# EAGLE design Shield H-Bridge (EAGLE 7.2.0)
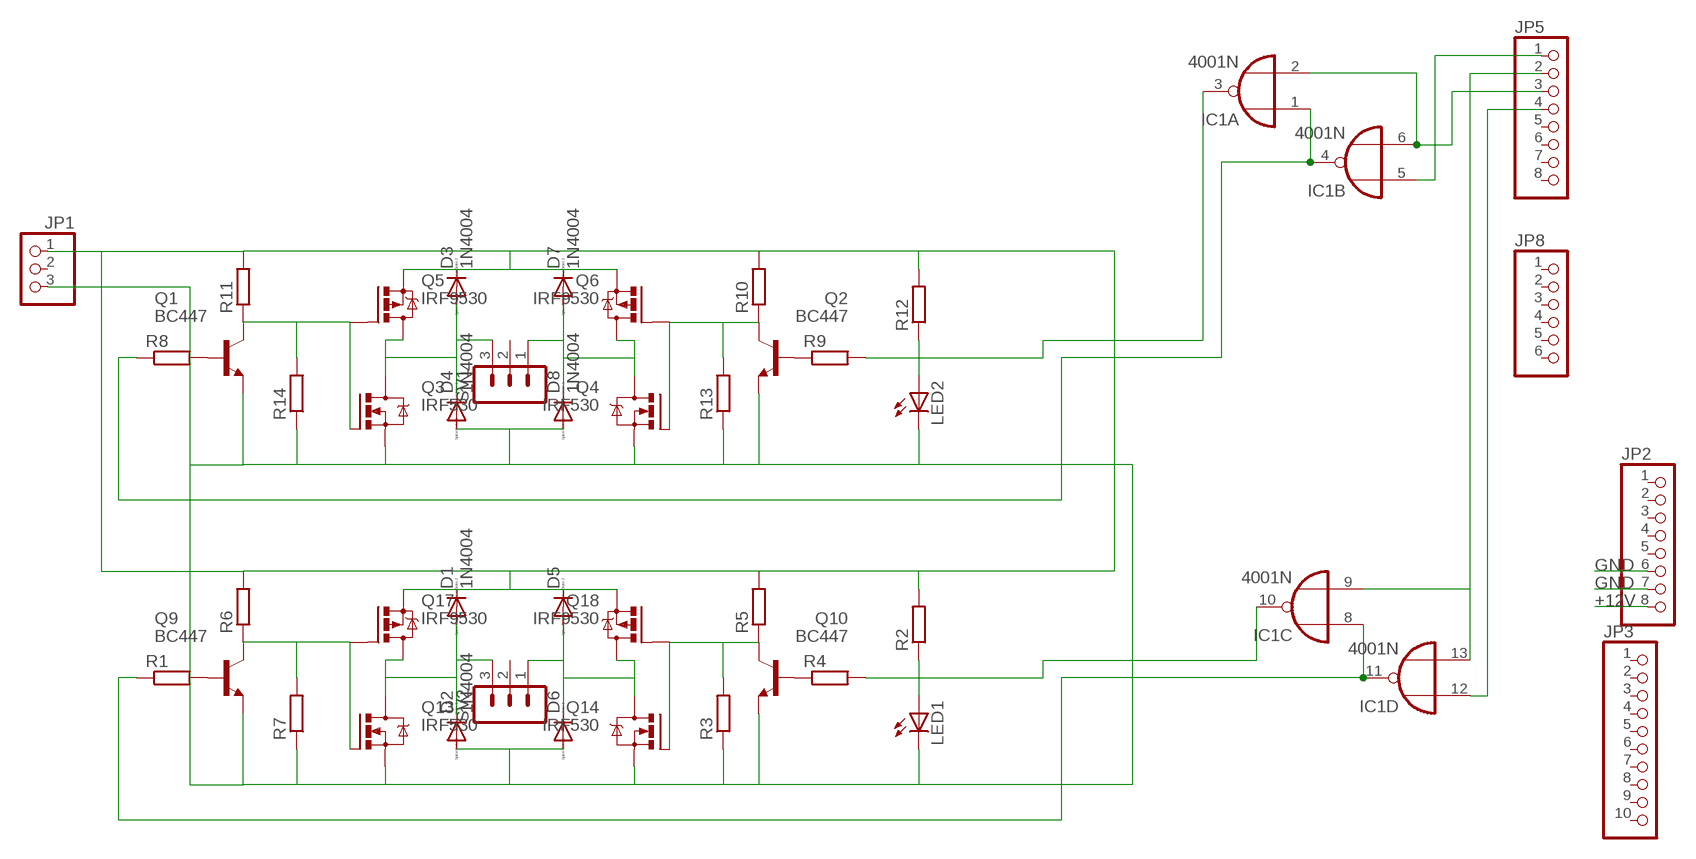
[diagram p0: schematic, sheet 1]

## Parts
D1  1N4004  [DO41-10]
D2  1N4004  [DO41-10]
D3  1N4004  [DO41-10]
D4  1N4004  [DO41-10]
D5  1N4004  [DO41-10]
D6  1N4004  [DO41-10]
D7  1N4004  [DO41-10]
D8  1N4004  [DO41-10]
IC1  4001N  [DIL14]
JP1  PINHD-1X3  [1X03]
JP2  PINHD-1X8  [1X08]
JP3  PINHD-1X10  [1X10]
JP5  PINHD-1X8  [1X08]
JP8  PINHD-1X6  [1X06]
LED1  LED3MM  [LED3MM]
LED2  LED3MM  [LED3MM]
Q1  BC447  [TO92-EBC]
Q2  BC447  [TO92-EBC]
Q3  IRF530  [TO220BV]
Q4  IRF530  [TO220BV]
Q5  IRF9530  [TO220BV]
Q6  IRF9530  [TO220BV]
Q9  BC447  [TO92-EBC]
Q10  BC447  [TO92-EBC]
Q13  IRF530  [TO220BV]
Q14  IRF530  [TO220BV]
Q17  IRF9530  [TO220BV]
Q18  IRF9530  [TO220BV]
R1  R-EU_0207/10  [0207/10]
R2  R-EU_0204/5  [0204/5]
R3  R-EU_0204/7  [0204/7]
R4  R-EU_0207/10  [0207/10]
R5  R-EU_0207/10  [0207/10]
R6  R-EU_0207/10  [0207/10]
R7  R-EU_0204/7  [0204/7]
R8  R-EU_0207/10  [0207/10]
R9  R-EU_0207/10  [0207/10]
R10  R-EU_0207/10  [0207/10]
R11  R-EU_0207/10  [0207/10]
R12  R-EU_0204/5  [0204/5]
R13  R-EU_0204/7  [0204/7]
R14  R-EU_0204/7  [0204/7]
SV1  MA03-1  [MA03-1]
SV2  MA03-1  [MA03-1]

## Nets
+12V: D1.C D3.C D5.C D7.C JP1.1 JP2.8 Q5.S Q6.S Q17.S Q18.S R2.2 R5.2 R6.2 R10.2 R11.2 R12.2
GND: D2.A D4.A D6.A D8.A JP1.3 JP2.6 JP2.7 LED1.K(C) LED2.K(C) Q1.E Q2.E Q3.S Q4.S Q9.E Q10.E Q13.S Q14.S R3.1 R7.1 R13.1 R14.1
N$1: Q9.B R1.2
N$2: Q10.B R4.1
N$3: D7.A D8.C Q4.D Q6.D SV1.1
N$4: IC1.12(D:I0) JP5.4
N$5: D3.A D4.C Q3.D Q5.D SV1.3
N$6: Q2.C Q4.G Q6.G R10.1 R13.2
N$7: D5.A D6.C Q14.D Q18.D SV2.1
N$8: D1.A D2.C Q13.D Q17.D SV2.3
N$9: LED1.A R2.1
N$10: Q1.B R8.2
N$11: Q2.B R9.1
N$12: Q10.C Q14.G Q18.G R3.2 R5.1
N$13: Q1.C Q3.G Q5.G R11.1 R14.2
N$14: LED2.A R12.1
N$15: IC1.2(A:I1) IC1.6(B:I1) JP5.3
N$18: Q9.C Q13.G Q17.G R6.1 R7.2
N$20: IC1.9(C:I1) IC1.13(D:I1) JP5.2
N$22: IC1.5(B:I0) JP5.1
PWM1: IC1.10(C:O) R4.2
PWM2: IC1.8(C:I0) IC1.11(D:O) R1.1
PWM3: IC1.1(A:I0) IC1.4(B:O) R8.1
PWM4: IC1.3(A:O) R9.2
Unconnected: JP1.2 JP2.1 JP2.2 JP2.3 JP2.4 JP2.5 JP3.1 JP3.2 JP3.3 JP3.4 JP3.5 JP3.6 JP3.7 JP3.8 JP3.9 JP3.10 JP5.5 JP5.6 JP5.7 JP5.8 JP8.1 JP8.2 JP8.3 JP8.4 JP8.5 JP8.6 SV1.2 SV2.2

## Power pins joined to a net without a drawn wire
VDD: IC1.14(P:VDD)
VSS: IC1.7(P:VSS)

## Library data of the parts
D1-D8 = diode:1N4004: DIODE general purpose rectifier, 1 A
IC1 = 40xx:4001: Quad 2-input NOR
JP1 = pinhead:PINHD-1X3: PIN HEADER
JP2 JP5 = pinhead:PINHD-1X8: PIN HEADER
JP3 = pinhead:PINHD-1X10: PIN HEADER
JP8 = pinhead:PINHD-1X6: PIN HEADER
LED1 LED2 = led:LED: LED OSRAM: - CHIPLED LG R971, LG N971, LY N971, LG Q971, LY Q971, LO R971, LY R971 LH N974, LH R974 LS Q976, LO Q976, LY Q976 LO Q996 - Hyper CHIPLED LW Q18S LB Q993, LB Q99A, LB R99A - SideLED LS A670, LO A670, LY A670, LG A670, LP A670 LB A673, LV A673, LT A673, LW A673 LH A674 LY A675 LS A676, LA A676, LO A676, LY A676, LW A676 LS A679, LY A679, LG A679 - Hyper Micro SIDELED® LS Y876, LA Y876, LO Y876, LY Y876 LT Y87S - SmartLED LW L88C, LW L88S LB L89C, LB L89S, LG L890 LS L89K, LO L89K, LY L89K LS L896, LA L896, LO L896, LY L896 - TOPLED LS T670, LO T670, LY T670, LG T670, LP T670 LSG T670, LSP T670, LSY T670, LOP T670, LYG T670 LG T671, LOG T671, LSG T671 LB T673, LV T673, LT T673, LW T673 LH T674 LS T676, LA T676, LO T676, LY T676, LB T676, LH T676, LSB T676, LW T676 LB T67C, LV T67C, LT T67C, LS T67K, LO T67K, LY T67K, LW E67C LS E67B, LA E67B, LO E67B, LY E67B, LB E67C, LV E67C, LT E67C LW T67C LS T679, LY T679, LG T679 LS T770, LO T770, LY T770, LG T770, LP T770 LB T773, LV T773, LT T773, LW T773 LH T774 LS E675, LA E675, LY E675, LS T675 LS T776, LA T776, LO T776, LY T776, LB T776 LHGB T686 LT T68C, LB T68C - Hyper Mini TOPLED® LB M676 - Mini TOPLED Santana® LG M470 LS M47K, LO M47K, LY M47K Source: http://www.osram.convergy.de LUXEON: - LUMILED® LXK2-PW12-R00, LXK2-PW12-S00, LXK2-PW14-U00, LXK2-PW14-V00 LXK2-PM12-R00, LXK2-PM12-S00, LXK2-PM14-U00 LXK2-PE12-Q00, LXK2-PE12-R00, LXK2-PE12-S00, LXK2-PE14-T00, LXK2-PE14-U00 LXK2-PB12-K00, LXK2-PB12-L00, LXK2-PB12-M00, LXK2-PB14-N00, LXK2-PB14-P00, LXK2-PB14-Q00 LXK2-PR12-L00, LXK2-PR12-M00, LXK2-PR14-Q00, LXK2-PR14-R00 LXK2-PD12-Q00, LXK2-PD12-R00, LXK2-PD12-S00 LXK2-PH12-R00, LXK2-PH12-S00 LXK2-PL12-P00, LXK2-PL12-Q00, LXK2-PL12-R00 Source: www.luxeon.com KINGBRIGHT: KA-3528ASYC Source: www.kingbright.com
Q1 Q2 Q9 Q10 = transistor-npn:BC447*: NPN Transistor
Q3 Q4 Q13 Q14 = transistor-power:IRF530: HEXFET Power MOSFET
Q5 Q6 Q17 Q18 = transistor-power:IRF9530: P-CHANNEL HEXFET POWER-MOS-FET Source: http://www.irf.com/product-info/datasheets/data/irf9530.pdf
R1-R14 = resistor:R-EU_: RESISTOR, European symbol
SV1 SV2 = con-lstb:MA03-1: PIN HEADER; OC_FARNELL: unknown; OC_NEWARK: unknown

## Board
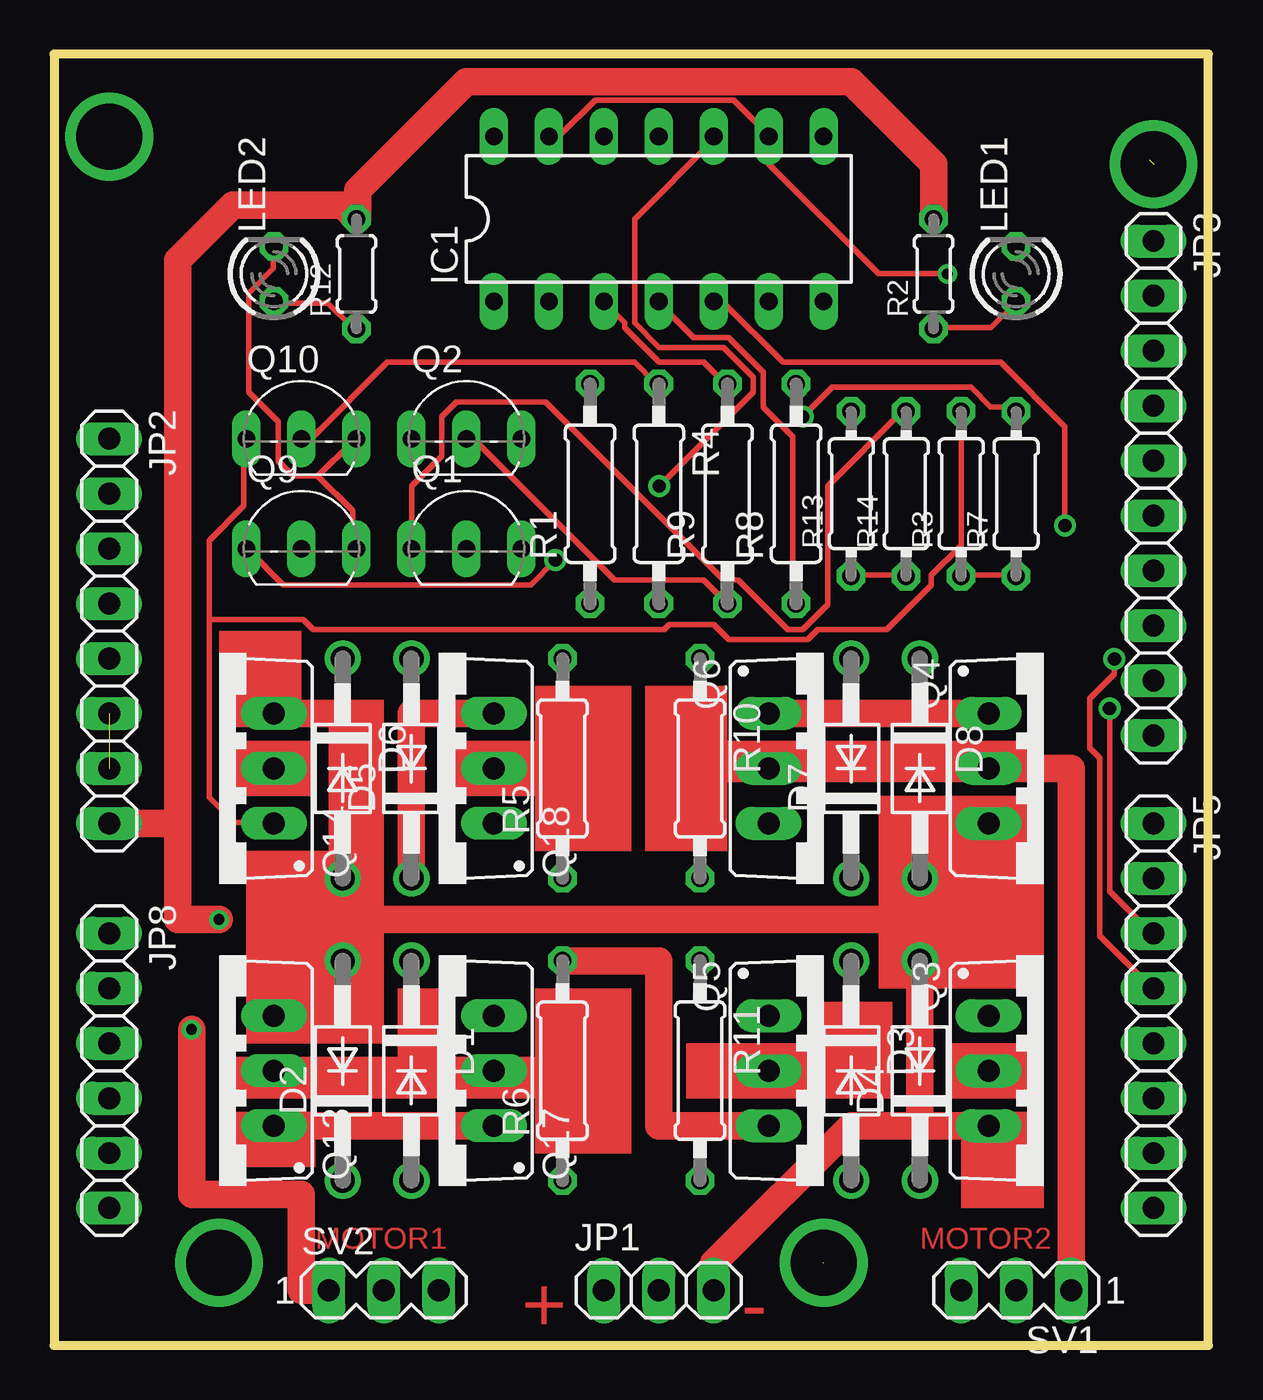
[diagram p1: board, top side]
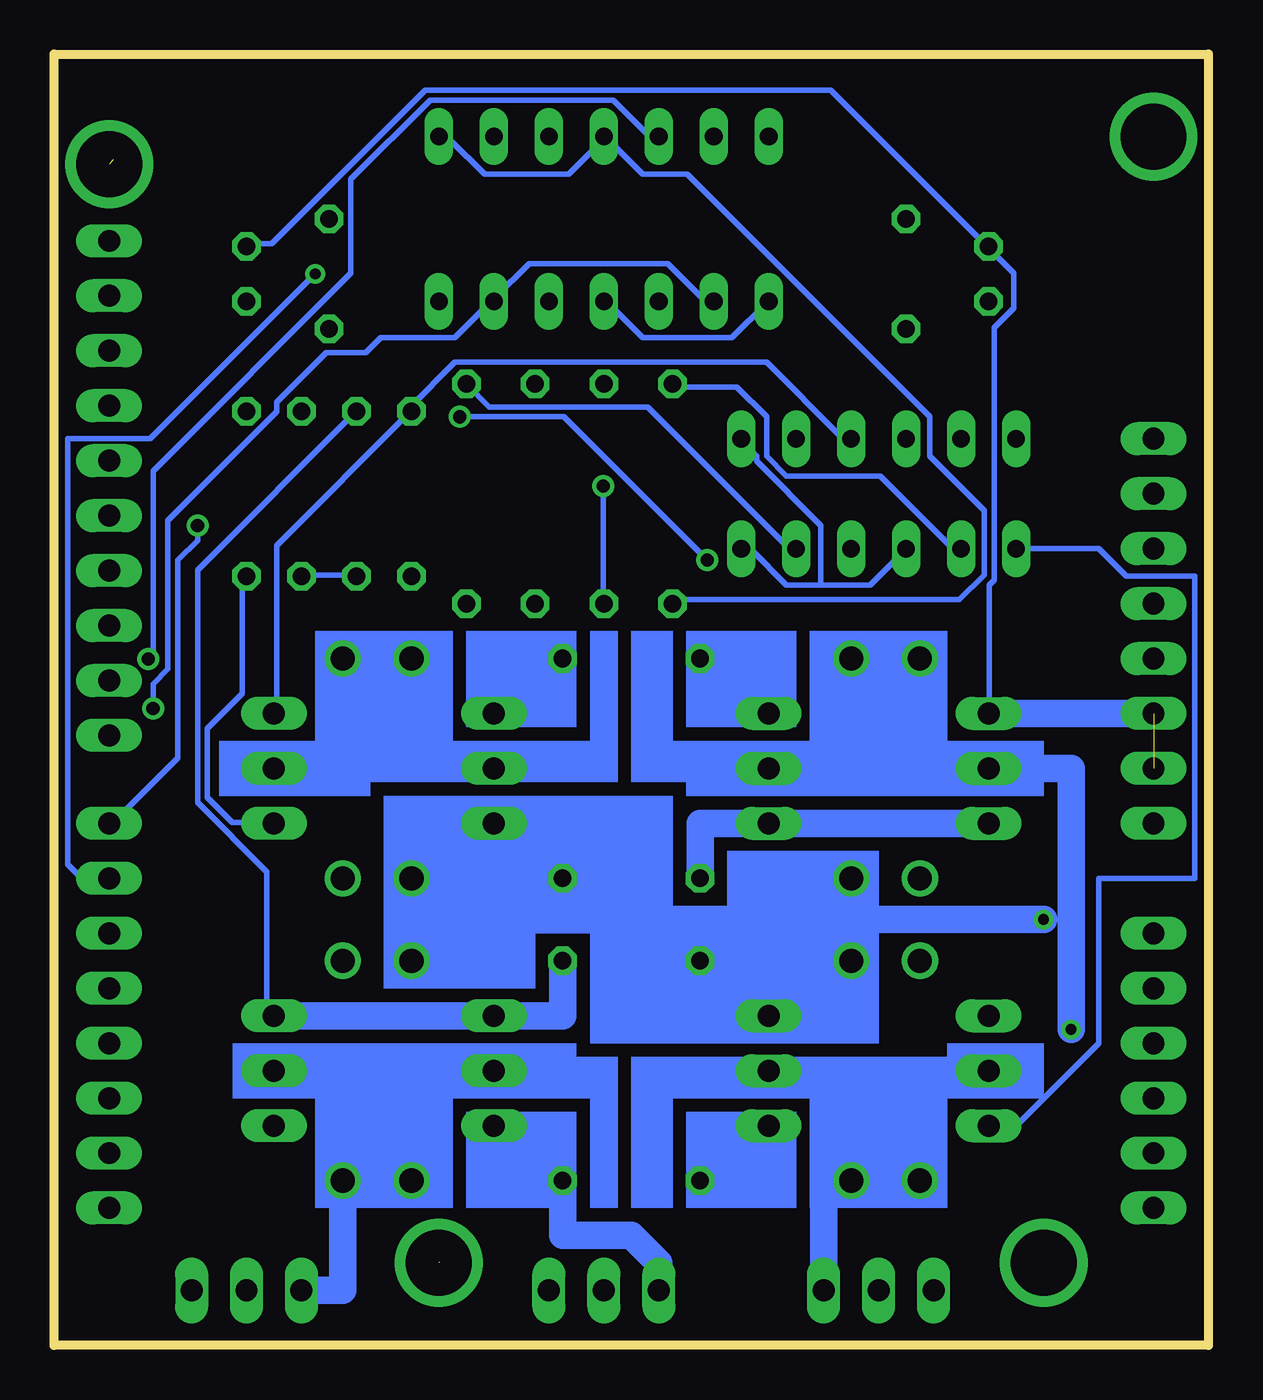
[diagram p2: board, bottom side, seen from below]

Size 53.34 x 59.69 mm. Coordinates in mm from the lower left corner, seen from the top.
Outline: 53.34,59.69 0,59.69 0,0 53.34,0 53.34,59.69
Copper layers (1*16): Top 0.035mm / dielectric 1.5mm / Bottom 0.035mm
Design rules "default": minimum track width 10mil, minimum drill 24mil, track to track 8mil, track to pad 8mil, pad to pad 8mil, via to via 8mil, smd to smd 8mil, copper to edge 40mil, drill to drill 8mil, minimum pad ring 10mil, minimum via ring 8mil, stop-mask expansion 4mil, vias tented up to drill 0mil, thermal gap 10mil

### Footprints (pad centres in the part's own frame; a part is rotated, then mirrored left to right if it is on the bottom)
DO41-10 = drill 1.118: A 5.08,0; C -5.08,0
DIL14 = drill 0.813 long: 1 -7.62,-3.81; 2 -5.08,-3.81; 3 -2.54,-3.81; 4 0,-3.81; 5 2.54,-3.81; 6 5.08,-3.81; 7 7.62,-3.81; 8 7.62,3.81; 9 5.08,3.81; 10 2.54,3.81; 11 0,3.81; 12 -2.54,3.81; 13 -5.08,3.81; 14 -7.62,3.81
1X03 = drill 1.016 long: 1 -2.54,0; 2 0,0; 3 2.54,0
1X08 = drill 1.016 long: 1 -8.89,0; 2 -6.35,0; 3 -3.81,0; 4 -1.27,0; 5 1.27,0; 6 3.81,0; 7 6.35,0; 8 8.89,0
1X10 = drill 1.016 long: 1 -11.43,0; 2 -8.89,0; 3 -6.35,0; 4 -3.81,0; 5 -1.27,0; 6 1.27,0; 7 3.81,0; 8 6.35,0; 9 8.89,0; 10 11.43,0
1X06 = drill 1.016 long: 1 -6.35,0; 2 -3.81,0; 3 -1.27,0; 4 1.27,0; 5 3.81,0; 6 6.35,0
LED3MM = drill 0.813 octagon: A -1.27,0; K 1.27,0
TO92-EBC = drill 0.813 long: B 0,-1.27; C -2.54,-1.27; E 2.54,-1.27
TO220BV = drill 1.016 long: D 0,-2.54; G -2.54,-2.54; S 2.54,-2.54
0207/10 = drill 0.813 octagon: 1 -5.08,0; 2 5.08,0
0204/5 = drill 0.813 octagon: 1 -2.54,0; 2 2.54,0
0204/7 = drill 0.813 octagon: 1 -3.81,0; 2 3.81,0
MA03-1 = drill 1.016 long: 1 -2.54,0; 2 0,0; 3 2.54,0

### Placement (x,y rotation side)
D1  16.51,12.7 270 top
D2  13.34,12.7 90 top
D3  36.83,12.7 270 top
D4  40.01,12.7 90 top
D5  16.51,26.67 90 top
D6  13.34,26.67 270 top
D7  36.83,26.67 90 top
D8  40.01,26.67 270 top
IC1  27.94,52.07 0 top
JP1  27.94,2.54 0 top
JP2  2.54,33.02 270 top
JP3  50.8,39.62 270 top
JP5  50.8,15.24 270 top
JP8  2.54,12.7 270 top
LED1  44.45,49.53 90 top
LED2  10.16,49.53 90 top
Q1  19.05,38.1 0 top
Q2  19.05,43.18 0 top
Q3  45.72,12.7 270 top
Q4  45.72,26.67 270 top
Q5  35.56,12.7 270 top
Q6  35.56,26.67 270 top
Q9  11.43,38.1 0 top
Q10  11.43,43.18 0 top
Q13  7.62,12.7 90 top
Q14  7.62,26.67 90 top
Q17  17.78,12.7 90 top
Q18  17.78,26.67 90 top
R1  24.77,39.37 90 top
R2  40.64,49.53 90 top
R3  41.91,39.37 90 top
R4  27.94,39.37 270 top
R5  23.5,26.67 90 top
R6  23.5,12.7 90 top
R7  44.45,39.37 90 top
R8  34.29,39.37 90 top
R9  31.12,39.37 90 top
R10  29.85,26.67 270 top
R11  29.85,12.7 270 top
R12  13.97,49.53 90 top
R13  36.83,39.37 90 top
R14  39.37,39.37 90 top
SV1  44.45,2.54 180 top
SV2  15.24,2.54 0 top

### Tracks (layer width: path | path; a pad name or v marks a point on that pad's centre or on a via)
+12V  (via drill 0.5)
  Top 0.254: 14.02,52.07 R12.2
  Top 1.27: R6.2 27.94,17.78 27.94,10.16 Q5.S | Q18.S 16.51,29.21 D5.C | v7.62,19.69 5.72,19.69 5.72,24.13 | 5.72,24.13 5.72,50.16 8.26,52.7 13.34,52.7 R12.2 | 14.02,52.07 14.02,53.39 19.05,58.42 36.83,58.42 40.64,54.61 R2.2 | JP2.8 5.72,24.13
  Bottom 1.27: D3.C D7.C 33.02,21.59 | D1.C 20.32,17.78 | 20.32,17.78 R6.2 | 33.02,21.59 R10.2 26.67,21.59 26.67,17.78 R6.2 | Q17.S 20.32,17.78 | Q6.S 33.02,21.59 | Q5.S 29.85,10.16 R11.2 29.85,5.08 26.67,5.08 25.4,3.81 JP1.1 | R6.2 D1.C | D1.C 16.51,19.69 | R5.2 23.5,29.21 Q18.S | D5.C 16.51,19.69 | 16.51,19.69 v7.62,19.69
GND  (1 unrouted)
  Top 0.254: R13.1 36.88,35.61 39.17,35.61 R14.1 | R3.1 41.91,35.61 44.43,35.61 R7.1 | 12.19,40.18 11.05,40.18 10.36,40.87 10.36,42.7 8.99,44.07 8.99,48.64 10.14,49.78 10.14,50.7 LED2.K | 12.19,40.18 13.79,41.78 Q10.E | 12.19,40.18 13.79,38.58 13.79,36.98 Q9.E
  Top 1.27: 40.01,19.05 D8.A 43.18,21.59 Q4.S | 40.01,19.05 D4.A 40.01,10.16 | 13.34,19.69 D2.A 10.16,17.78 Q13.S | 13.34,19.69 D6.A 13.34,29.21 Q14.S | 13.34,19.69 39.37,19.69 40.01,19.05 | JP1.3 30.48,3.81 36.83,10.16 40.01,10.16 | Q3.S 40.01,10.16
  Bottom 0.254: R14.1 39.4,35.61 41.91,35.61 R3.1 | R7.1 44.65,35.38 44.65,30.12 46.25,28.52 46.25,25.32 45.11,24.18 43.28,24.18 Q4.S | 17.91,35.15 15.62,35.15 14.02,36.75 Q9.E | 17.91,35.15 19.51,35.15 21.11,36.75 21.57,36.75 Q1.E | 17.91,35.15 17.91,37.9 20.88,40.87 20.88,41.1 21.57,41.78 Q2.E | LED1.K 44.43,50.93 43.28,50.93 36.2,58.01 17.45,58.01 10.36,50.93 LED2.K 10.14,50.7 8.99,49.55 8.99,47.95 9.91,47.04 9.91,35.38 10.14,35.15 10.14,29.21 Q14.S
  Bottom 1.27: JP2.6 Q14.S
N$1
  Bottom 0.254: Q9.B 11.51,36.98 11.96,36.98 15.16,40.18 19.51,40.18 20.42,41.1 20.42,42.93 21.79,44.3 24.77,44.3 R1.2
N$2
  Top 0.254: Q10.B 11.51,42.01 11.96,42.01 15.39,45.44 26.82,45.44 27.74,44.53 R4.1
N$3
  Top 1.27: SV1.1 46.99,26.67 Q4.D
  Bottom 1.27: Q6.D 40.64,26.67 | 40.64,26.67 Q4.D | D7.A D8.C 40.01,27.3 40.64,26.67
N$4  (via drill 0.61)
  Top 0.254: v49,31.73 49,31.04 47.85,29.9 47.85,27.61 48.31,27.15 48.31,18.92 50.6,16.64 JP5.4
  Bottom 0.254: v49,31.73 48.77,31.95 48.77,40.41 39.62,49.55 39.62,53.9 35.97,57.56 27.51,57.56 25.91,55.96 25.45,55.96 IC1.12
N$5
  Bottom 1.27: Q3.D 36.83,12.7 | 36.83,12.7 Q5.D | 36.83,12.7 D3.A D4.C 40.01,2.54 SV1.3
N$6
  Top 1.27: Q4.G Q6.G
  Bottom 0.254: Q2.C 16.54,42.01 16.99,42.01 20.42,45.44 34.82,45.44 36.88,43.38 R13.2 36.88,43.16 43.05,36.98 43.05,29.21 Q4.G
  Bottom 1.27: Q6.G 29.85,29.21 R10.1
N$7  (via drill 0.5)
  Top 1.27: v6.35,14.61 6.35,6.98 11.43,6.98 11.43,2.54 SV2.1
  Bottom 1.27: D5.A D6.C 13.34,27.3 13.97,26.67 | Q14.D 13.97,26.67 | 13.97,26.67 Q18.D Q14.D | Q14.D 6.35,26.67 v6.35,14.61
N$8
  Top 0.254: 16.54,7.49 D1.A
  Bottom 1.27: Q13.D 13.34,12.7 | 13.34,12.7 Q17.D | 13.34,12.7 D2.C D1.A 17.78,7.62 SV2.3
N$9
  Top 0.254: R2.1 40.77,47.04 43.28,47.04 44.43,48.18 LED1.A
N$10
  Bottom 0.254: R8.2 33.22,43.38 25.91,43.38 19.51,36.98 19.05,36.98 Q1.B
N$11
  Top 0.254: R9.1 30.02,35.38 25.91,35.38 19.51,41.78 19.05,41.78 Q2.B
N$12
  Top 0.254: 7.16,33.55 7.16,25.32 8.31,24.18 10.14,24.18 Q14.G | 7.16,33.55 7.16,37.21 8.76,38.81 8.76,41.78 Q10.C | R3.2 41.91,36.98 40.54,35.61 40.54,35.15 38.48,33.1 35.28,33.1 34.82,32.64 31.17,32.64 30.48,33.33 28.42,33.33 28.19,33.1 11.96,33.1 11.51,33.55 7.16,33.55
  Bottom 1.27: Q14.G Q18.G 23.5,24.13 R5.1
N$13
  Top 0.254: Q1.C 16.54,36.98 16.54,39.73 17.91,41.1 17.91,42.93 18.59,43.61 22.71,43.61 30.94,35.38 31.62,35.38 33.91,33.1 34.59,33.1 35.74,34.24 35.74,39.73 39.17,43.16 R14.2
  Bottom 0.254: R14.2 46.71,35.84 46.71,25.09 43.51,21.89 43.51,15.72 Q3.G
  Bottom 1.27: Q3.G Q5.G 29.85,15.24 R11.1
N$14
  Top 0.254: LED2.A 10.36,48.18 12.65,48.18 13.79,47.04 R12.1
N$15  (via drill 0.61)
  Top 0.254: v48.77,29.44 48.77,20.98 50.6,19.15 JP5.3
  Bottom 0.254: IC1.2 22.94,48.41 23.39,48.41 24.99,50.01 31.39,50.01 33,48.41 IC1.6 33.22,48.18 34.82,46.58 38.25,46.58 38.94,45.9 40.77,45.9 43.05,43.61 43.05,43.16 48.08,38.12 48.08,31.27 48.77,30.58 v48.77,29.44
N$16  (via drill 3.05 pad 4.06)
  other vias: 2.54,55.88
N$18  (via drill 0.61)
  Top 0.254: v34.59,42.93 35.97,44.3 42.37,44.3 43.28,43.38 44.43,43.38 R7.2 | v23.17,36.3 22.02,35.15 10.59,35.15 8.99,36.75 Q9.C
  Top 1.27: Q13.G Q17.G
  Bottom 0.254: v34.59,42.93 29.79,42.93 v23.17,36.3 | Q13.G 8.89,10.16 5.08,13.97 5.08,21.59 0.64,21.59 0.64,35.56 3.81,35.56 5.08,36.83 Q9.C
  Bottom 1.27: Q17.G 23.5,10.16 R6.1
N$19  (via drill 3.05 pad 4.06)  (1 unrouted)
  other vias: 50.8,54.61
N$20  (via drill 0.5)
  Top 0.254: IC1.13 22.94,55.96 23.39,55.96 24.99,57.56 31.39,57.56 33,55.96 IC1.9 33.02,54.61 38.1,49.53 v41.28,49.53
  Bottom 0.254: v41.28,49.53 48.9,41.91 52.71,41.91 52.71,22.22 52.07,21.59 JP5.2
N$21  (via drill 3.05 pad 4.06)
  other vias: 7.62,3.81
N$22  (via drill 0.61)
  Top 0.254: v46.71,37.9 46.71,42.47 43.74,45.44 33.68,45.44 30.94,48.18 30.48,48.18 IC1.5
  Bottom 0.254: v46.71,37.9 46.71,37.21 47.62,36.3 47.62,27.15 50.6,24.18 JP5.1
N$23  (via drill 3.05 pad 4.06)  (1 unrouted)
  other vias: 35.56,3.81
PWM1  (via drill 0.61)
  Top 0.254: v27.97,39.73 32.31,44.07 32.31,44.76 30.94,46.13 27.97,46.13 26.82,47.27 26.82,52.07 30.48,55.73 IC1.10
  Bottom 0.254: v27.97,39.73 27.97,34.47 R4.2
PWM2
  Bottom 0.254: R1.1 24.77,34.47 11.51,34.47 10.36,35.61 10.36,38.58 12.88,41.1 12.88,42.93 24.08,54.13 26.14,54.13 27.74,55.73 IC1.11 27.97,55.73 29.57,54.13 33.45,54.13 35.05,55.73 35.51,55.73 IC1.8
PWM3
  Top 0.254: R8.1 34.14,34.47 34.14,42.01 32.77,43.38 32.77,44.98 31.17,46.58 29.57,46.58 27.97,48.18 IC1.4
  Bottom 0.254: IC1.1 20.42,48.18 22.02,46.58 26.14,46.58 27.74,48.18 IC1.4
PWM4
  Top 0.254: IC1.3 25.45,48.18 26.37,47.27 26.37,47.04 27.97,45.44 30.02,45.44 30.94,44.53 R9.2
(copper drawn outside any net)
  shapes: Bottom area x29, Top area x17

### Text on the board
Top: MOTOR1 | MOTOR2 | + | -